# EAGLE schematic MMC_2 (EAGLE 9.6.2)
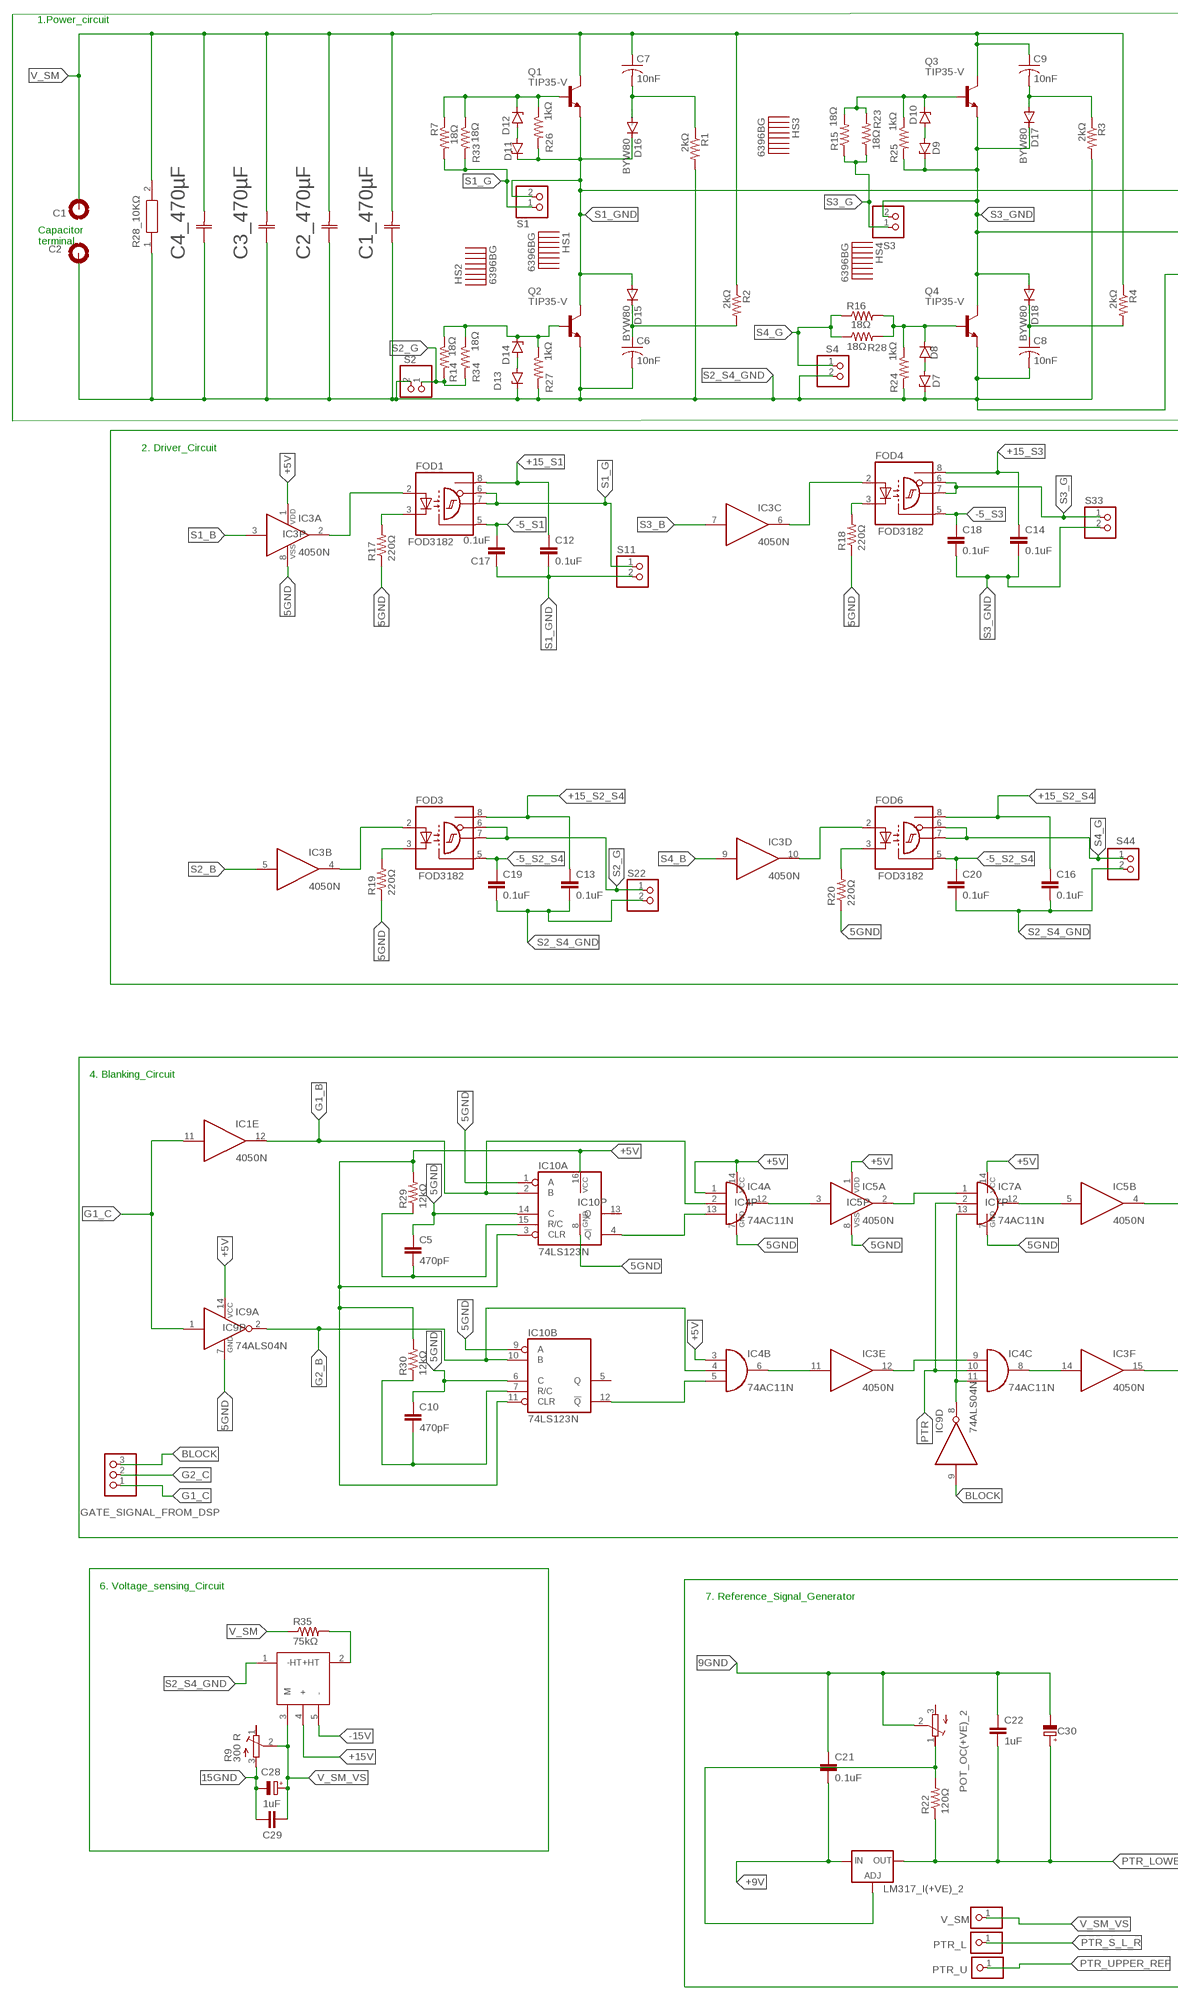
[diagram p0: schematic, sheet 1, part 1 of 2]
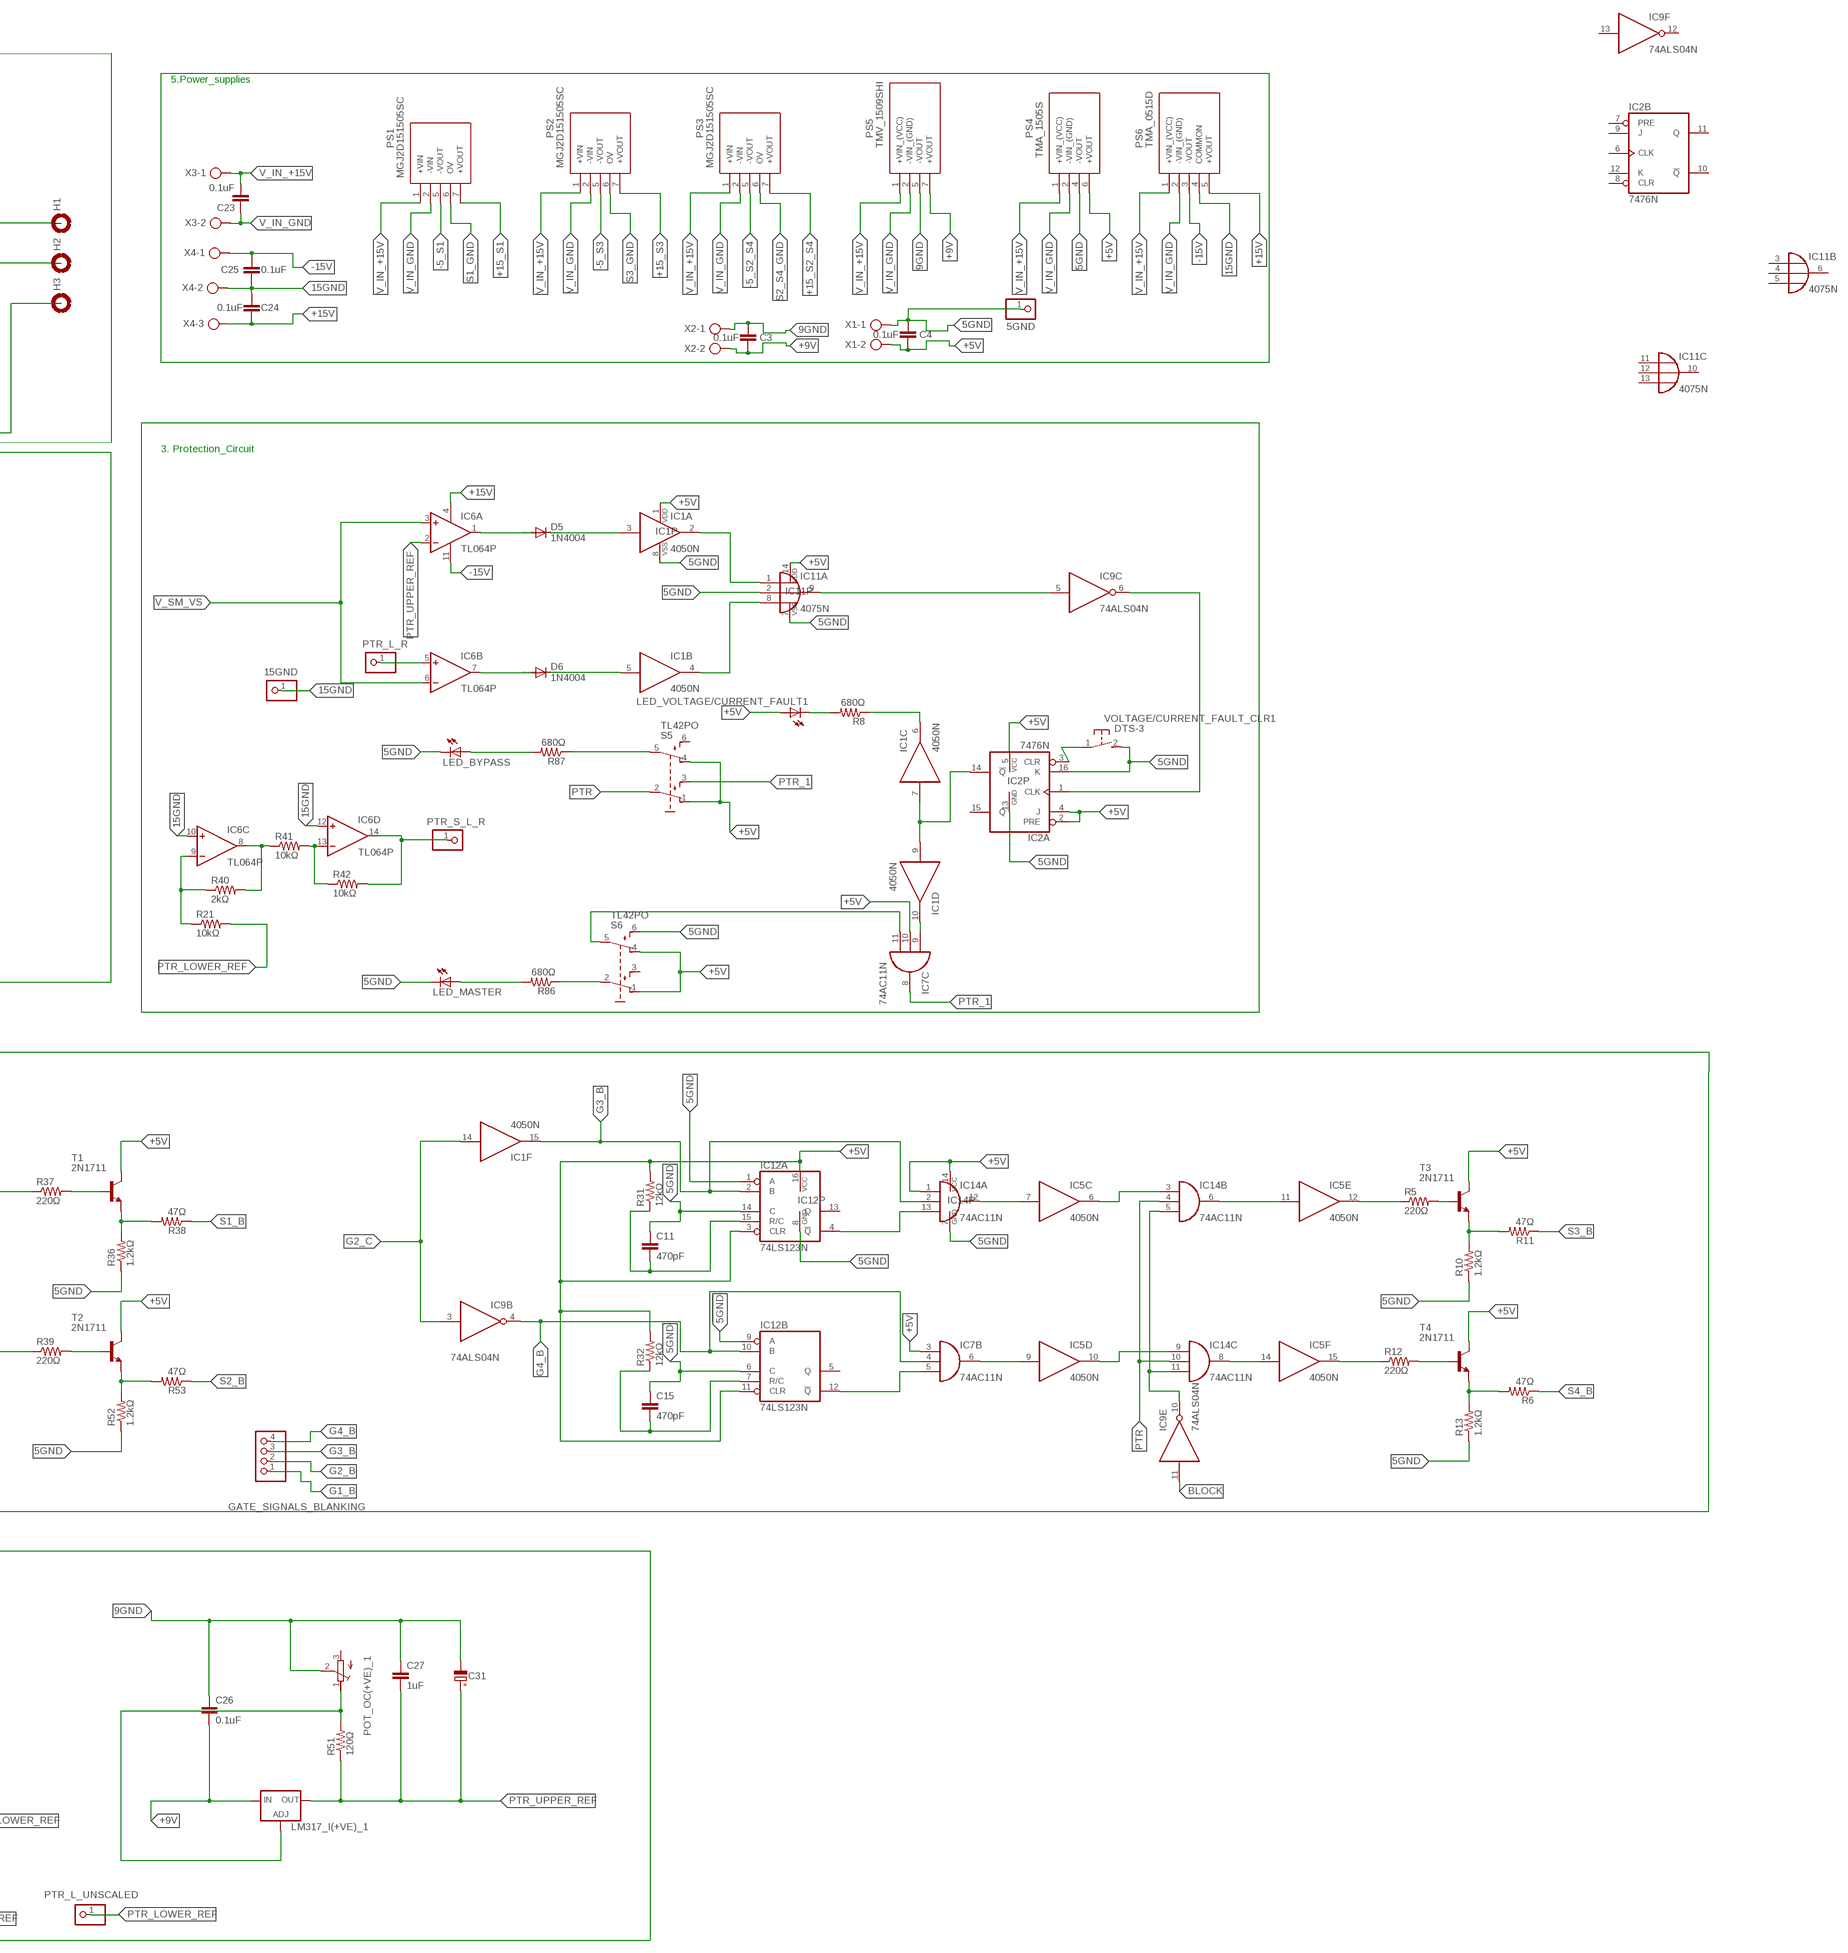
[diagram p1: schematic, sheet 1, part 2 of 2]

## Parts
5GND  PINHD-1X1  [1X01]
15GND  PINHD-1X1  [1X01]
C1  MOUNT-PAD-ROUND  [6-PAD]
C1_470µF  MAL215746471E3  [CAP_2157_30X50_VIS]
C2  MOUNT-PAD-ROUND  [6-PAD]
C2_470µF  MAL215746471E3  [CAP_2157_30X50_VIS]
C3  0.1uF  C-EU025-025X050  [C025-025X050]
C3_470µF  MAL215746471E3  [CAP_2157_30X50_VIS]
C4  0.1uF  C-EU025-025X050  [C025-025X050]
C4_470µF  MAL215746471E3  [CAP_2157_30X50_VIS]
C5  470pF  C-EU025-025X050  [C025-025X050]
C6  10nF  C-US150-054X183  [C150-054X183]
C7  10nF  C-US150-054X183  [C150-054X183]
C8  10nF  C-US150-054X183  [C150-054X183]
C9  10nF  C-US150-054X183  [C150-054X183]
C10  470pF  C-EU025-025X050  [C025-025X050]
C11  470pF  C-EU025-025X050  [C025-025X050]
C12  0.1uF  C-EU025-025X050  [C025-025X050]
C13  0.1uF  C-EU025-025X050  [C025-025X050]
C14  0.1uF  C-EU025-025X050  [C025-025X050]
C15  470pF  C-EU025-025X050  [C025-025X050]
C16  0.1uF  C-EU025-025X050  [C025-025X050]
C17  0.1uF  C-EU025-025X050  [C025-025X050]
C18  0.1uF  C-EU025-025X050  [C025-025X050]
C19  0.1uF  C-EU025-025X050  [C025-025X050]
C20  0.1uF  C-EU025-025X050  [C025-025X050]
C21  0.1uF  C-EU025-025X050  [C025-025X050]
C22  1uF  C-EU025-025X050  [C025-025X050]
C23  0.1uF  C-EU025-025X050  [C025-025X050]
C24  0.1uF  C-EU025-025X050  [C025-025X050]
C25  0.1uF  C-EU025-025X050  [C025-025X050]
C26  0.1uF  C-EU025-025X050  [C025-025X050]
C27  1uF  C-EU025-025X050  [C025-025X050]
C28  CPOL-EUE2-4  [E2-4]
C29  1uF  C-EU025-025X050  [C025-025X050]
C30  CPOL-EUE2-4  [E2-4]
C31  CPOL-EUE2-4  [E2-4]
D5  1N4004  [DO41-10]
D6  1N4004  [DO41-10]
D7  ZENER-DIODEDO35Z10  [DO35Z10]
D8  ZENER-DIODEDO35Z10  [DO35Z10]
D9  ZENER-DIODEDO35Z10  [DO35Z10]
D10  ZENER-DIODEDO35Z10  [DO35Z10]
D11  ZENER-DIODEDO35Z10  [DO35Z10]
D12  ZENER-DIODEDO35Z10  [DO35Z10]
D13  ZENER-DIODEDO35Z10  [DO35Z10]
D14  ZENER-DIODEDO35Z10  [DO35Z10]
D15  BYW80  [TO220ACS]
D16  BYW80  [TO220ACS]
D17  BYW80  [TO220ACS]
D18  BYW80  [TO220ACS]
FOD1  FOD3182  HCPL2219  [DIL08]
FOD3  FOD3182  HCPL2219  [DIL08]
FOD4  FOD3182  HCPL2219  [DIL08]
FOD6  FOD3182  HCPL2219  [DIL08]
GATE_SIGNAL_FROM_DSP  PINHD-1X3  [1X03]
GATE_SIGNALS_BLANKING  PINHD-1X4  [1X04]
H1  MOUNT-PAD-ROUND  [6-PAD]
H2  MOUNT-PAD-ROUND  [6-PAD]
H3  MOUNT-PAD-ROUND  [6-PAD]
HS1  6396BG  [HSINK_6396BG]
HS2  6396BG  [HSINK_6396BG]
HS3  6396BG  [HSINK_6396BG]
HS4  6396BG  [HSINK_6396BG]
IC1  4050N  [DIL16]
IC2  7476N  [DIL16]
IC3  4050N  [DIL16]
IC4  74AC11N  [DIL14]
IC5  4050N  [DIL16]
IC6  TL064P  [DIL14]
IC7  74AC11N  [DIL14]
IC8  LV25-P  [LV25-P]
IC9  74ALS04N  [DIL14]
IC10  74LS123N  [DIL16]
IC11  4075N  [DIL14]
IC12  74LS123N  [DIL16]
IC14  74AC11N  [DIL14]
LED_BYPASS  LED3MM  [LED3MM]
LED_MASTER  LED3MM  [LED3MM]
LED_VOLTAGE/CURRENT_FAULT1  LED3MM  [LED3MM]
LM317_I(+VE)_1  LM317TS  [317TS]
LM317_I(+VE)_2  LM317TS  [317TS]
POT_OC(+VE)_1  R-TRIMMT93YA  [RTRIMT93YA]
POT_OC(+VE)_2  R-TRIMMT93YA  [RTRIMT93YA]
PS1  MGJ2D151505SC  [MGJ2D151505SC]
PS2  MGJ2D151505SC  [MGJ2D151505SC]
PS3  MGJ2D151505SC  [MGJ2D151505SC]
PS4  TMA_1505S  [TMA0505S]
PS5  TMV_1509SHI  [TMV1512SHI]
PS6  TMA_0515D  [TMA0515D]
PTR_L  PINHD-1X1  [1X01]
PTR_L_R  PINHD-1X1  [1X01]
PTR_L_UNSCALED  PINHD-1X1  [1X01]
PTR_S_L_R  PINHD-1X1  [1X01]
PTR_U  PINHD-1X1  [1X01]
Q1  TIP35-V  [TO247-V]
Q2  TIP35-V  [TO247-V]
Q3  TIP35-V  [TO247-V]
Q4  TIP35-V  [TO247-V]
R1  2kΩ  R-US_0414/15  [0414/15]
R2  2kΩ  R-US_0414/15  [0414/15]
R3  2kΩ  R-US_0414/15  [0414/15]
R4  2kΩ  R-US_0414/15  [0414/15]
R5  220Ω  R-US_0207/10  [0207/10]
R6  47Ω  R-US_0207/10  [0207/10]
R7  18Ω  R-US_0207/10  [0207/10]
R8  680Ω  R-US_0207/10  [0207/10]
R9  300 R  R-TRIMMT93YA  [RTRIMT93YA]
R10  1.2kΩ  R-US_0207/10  [0207/10]
R11  47Ω  R-US_0207/10  [0207/10]
R12  220Ω  R-US_0207/10  [0207/10]
R13  1.2kΩ  R-US_0207/10  [0207/10]
R14  18Ω  R-US_0207/10  [0207/10]
R15  18Ω  R-US_0207/10  [0207/10]
R16  18Ω  R-US_0207/10  [0207/10]
R17  220Ω  R-US_0207/10  [0207/10]
R18  220Ω  R-US_0207/10  [0207/10]
R19  220Ω  R-US_0207/10  [0207/10]
R20  220Ω  R-US_0207/10  [0207/10]
R21  10kΩ  R-US_0207/10  [0207/10]
R22  120Ω  R-US_0207/10  [0207/10]
R23  18Ω  R-US_0207/10  [0207/10]
R24  1kΩ  R-US_0207/10  [0207/10]
R25  1kΩ  R-US_0207/10  [0207/10]
R26  1kΩ  R-US_0207/10  [0207/10]
R27  1kΩ  R-US_0207/10  [0207/10]
R28  18Ω  R-US_0207/10  [0207/10]
R28_10KΩ  SBCHE610KJ  [SBCHE610KJ]
R29  12kΩ  R-US_0207/10  [0207/10]
R30  12kΩ  R-US_0207/10  [0207/10]
R31  12kΩ  R-US_0207/10  [0207/10]
R32  12kΩ  R-US_0207/10  [0207/10]
R33  18Ω  R-US_0207/10  [0207/10]
R34  18Ω  R-US_0207/10  [0207/10]
R35  75kΩ  R-US_0411/15  [0411/15]
R36  1.2kΩ  R-US_0207/10  [0207/10]
R37  220Ω  R-US_0207/10  [0207/10]
R38  47Ω  R-US_0207/10  [0207/10]
R39  220Ω  R-US_0207/10  [0207/10]
R40  2kΩ  R-US_0207/10  [0207/10]
R41  10kΩ  R-US_0207/10  [0207/10]
R42  10kΩ  R-US_0207/10  [0207/10]
R51  120Ω  R-US_0207/10  [0207/10]
R52  1.2kΩ  R-US_0207/10  [0207/10]
R53  47Ω  R-US_0207/10  [0207/10]
R86  680Ω  R-US_0207/10  [0207/10]
R87  680Ω  R-US_0207/10  [0207/10]
S1  PINHD-1X2  [1X02]
S2  PINHD-1X2  [1X02]
S3  PINHD-1X2  [1X02]
S4  PINHD-1X2  [1X02]
S5  TL42PO  [TL4XPO]
S6  TL42PO  [TL4XPO]
S11  PINHD-1X2  [1X02]
S22  PINHD-1X2  [1X02]
S33  PINHD-1X2  [1X02]
S44  PINHD-1X2  [1X02]
T1  2N1711  [TO39]
T2  2N1711  [TO39]
T3  2N1711  [TO39]
T4  2N1711  [TO39]
V_SM  PINHD-1X1  [1X01]
VOLTAGE/CURRENT_FAULT_CLR1  DTS-3  [DTS-3]
X1  AK300/2  [AK300/2]
X2  AK300/2  [AK300/2]
X3  AK300/2  [AK300/2]
X4  AK300/3  [AK300/3]

## Nets
5GND: 5GND.1 C4.2 C5.1 C10.1 C11.1 C15.1 IC1.8(P:VSS) IC2.13(P:GND) IC2.16(A:K) IC3.8(P:VSS) IC4.7(P:GND) IC5.8(P:VSS) IC7.7(P:GND) IC9.7(P:GND) IC10.1(A:A) IC10.6(B:C) IC10.8(P:GND) IC10.9(B:A) IC10.14(A:C) IC11.2(A:I1) IC11.7(P:VSS) IC12.1(A:A) IC12.6(B:C) IC12.8(P:GND) IC12.9(B:A) IC12.14(A:C) IC14.7(P:GND) LED_BYPASS.K(C) LED_MASTER.K(C) PS4.4(-VOUT) R10.1 R13.1 R17.1 R18.1 R19.1 R20.1 R36.1 R52.1 S6.6(S1) VOLTAGE/CURRENT_FAULT_CLR1.2 X1.1
9GND: C3.2 C21.1 C22.1 C26.1 C27.1 C30.- C31.- POT_OC(+VE)_1.2(S) POT_OC(+VE)_2.2(S) PS5.5(-VOUT) X2.1
15GND: 15GND.1 C24.2 C25.2 C28.- C29.2 IC6.10(C:+IN) IC6.12(D:+IN) PS6.4(COMMON) R9.3(A) X4.2
+5V: C4.1 IC1.1(P:VDD) IC2.2(A:PRE) IC2.4(A:J) IC2.5(P:VCC) IC3.1(P:VDD) IC4.1(A:I0) IC4.3(B:I0) IC4.14(P:VCC) IC5.1(P:VDD) IC7.3(B:I0) IC7.10(C:I1) IC7.14(P:VCC) IC9.14(P:VCC) IC10.3(A:CLR) IC10.11(B:CLR) IC10.16(P:VCC) IC11.14(P:VDD) IC12.3(A:CLR) IC12.11(B:CLR) IC12.16(P:VCC) IC14.1(A:I0) IC14.14(P:VCC) LED_VOLTAGE/CURRENT_FAULT1.A PS4.6(+VOUT) R29.2 R30.2 R31.2 R32.2 S5.1(O) S5.4(O1) S6.1(O) S6.4(O1) T1.3(C) T2.3(C) T3.3(C) T4.3(C) X1.2
+9V: C3.1 C21.2 C26.2 LM317_I(+VE)_1.3(IN) LM317_I(+VE)_2.3(IN) PS5.7(+VOUT) X2.2
+15_S1: C12.1 FOD1.8(VCC) PS1.7(+VOUT)
+15_S2_S4: C13.1 C16.1 FOD3.8(VCC) FOD6.8(VCC) PS3.7(+VOUT)
+15_S3: C14.1 FOD4.8(VCC) PS2.7(+VOUT)
+15V: C24.1 IC6.4(P:V+) IC8.4(+) PS6.5(+VOUT) X4.3
-5_S1: C17.2 FOD1.5(GND) PS1.5(-VOUT)
-5_S2_S4: C19.1 C20.1 FOD3.5(GND) FOD6.5(GND) PS3.5(-VOUT)
-5_S3: C18.1 FOD4.5(GND) PS2.5(-VOUT)
-15V: C25.1 IC6.11(P:V-) IC8.5(-) PS6.3(-VOUT) X4.1
AA: D12.C Q1.1(B) R7.1 R26.1 R33.1
BLOCK: GATE_SIGNAL_FROM_DSP.3 IC9.9(D:I) IC9.11(E:I)
G1_B: GATE_SIGNALS_BLANKING.1 IC1.12(E:O) IC4.2(A:I1) IC10.2(A:B)
G1_C: GATE_SIGNAL_FROM_DSP.1 IC1.11(E:I) IC9.1(A:I)
G2_B: GATE_SIGNALS_BLANKING.2 IC4.4(B:I1) IC9.2(A:O) IC10.10(B:B)
G2_C: GATE_SIGNAL_FROM_DSP.2 IC1.14(F:I) IC9.3(B:I)
G3_B: GATE_SIGNALS_BLANKING.3 IC1.15(F:O) IC12.2(A:B) IC14.2(A:I1)
G4_B: GATE_SIGNALS_BLANKING.4 IC7.4(B:I1) IC9.4(B:O) IC12.10(B:B)
GND(5): FOD3.3(C) R19.2
N$1: FOD1.2(A) IC3.2(A:O)
N$2: D8.C Q4.1(B) R16.2 R24.1 R28.2
N$3: D10.C Q3.1(B) R15.2 R23.2 R25.1
N$4: IC7.11(C:I2) S6.5(P1)
N$5: D5.A IC6.1(A:OUT)
N$6: IC1.10(D:O) IC7.9(C:I0)
N$7: C9.2 D17.A R3.1
N$9: IC12.4(A:!Q) IC14.13(A:I2)
N$10: IC5.7(C:I) IC14.12(A:O)
N$11: IC5.6(C:O) IC14.3(B:I0)
N$12: IC5.11(E:I) IC14.6(B:O)
N$13: IC5.12(E:O) R5.1
N$14: R5.2 T3.2(B)
N$15: C8.1 D18.C R4.2
N$16: R10.2 R11.2 T3.1(E)
N$17: IC5.15(F:O) R12.1
N$18: C6.1 D15.C R2.2
N$20: FOD3.2(A) IC3.4(B:O)
N$22: FOD4.2(A) IC3.6(C:O)
N$24: FOD6.2(A) IC3.10(D:O)
N$26: FOD1.3(C) R17.2
N$27: FOD4.3(C) R18.2
N$28: FOD6.3(C) R20.2
N$30: R12.2 T4.2(B)
N$31: R6.2 R13.2 T4.1(E)
N$32: D5.C IC1.3(A:I)
N$33: IC5.5(B:I) IC7.12(A:O)
N$35: IC4.11(C:I2) IC7.13(A:I2) IC9.8(D:O)
N$36: IC7.5(B:I2) IC12.12(B:!Q)
N$37: IC5.9(D:I) IC7.6(B:O)
N$38: IC5.10(D:O) IC14.9(C:I0)
N$39: IC9.10(E:O) IC14.5(B:I2) IC14.11(C:I2)
N$40: IC5.14(F:I) IC14.8(C:O)
N$41: IC6.5(B:+IN) PTR_L_R.1
N$43: IC8.2(+HT) R35.2
N$45: LM317_I(+VE)_1.1(ADJ) POT_OC(+VE)_1.1(E) R51.2
N$46: C7.2 D16.A R1.1
N$48: IC6.9(C:-IN) R21.1 R40.1
N$49: IC6.8(C:OUT) R40.2 R41.1
N$51: D7.A D8.A
N$52: D9.A D10.A
N$53: D11.A D12.A
N$54: D13.A D14.A
N$55: IC9.5(C:I) IC11.9(A:O)
N$56: IC6.13(D:-IN) R41.2 R42.1
N$57: IC1.2(A:O) IC11.1(A:I0)
N$58: D6.A IC6.7(B:OUT)
N$59: IC1.4(B:O) IC11.8(A:I2)
N$60: D6.C IC1.5(B:I)
N$61: LM317_I(+VE)_2.1(ADJ) POT_OC(+VE)_2.1(E) R22.2
N$63: IC2.1(A:CLK) IC9.6(C:O)
N$64: IC1.6(C:O) R8.1
N$65: LED_VOLTAGE/CURRENT_FAULT1.K(C) R8.2
N$67: IC2.3(A:CLR) VOLTAGE/CURRENT_FAULT_CLR1.1
N$90: C5.2 IC10.15(A:R/C) R29.1
N$91: C10.2 IC10.7(B:R/C) R30.1
N$92: C11.2 IC12.15(A:R/C) R31.1
N$95: IC4.13(A:I2) IC10.4(A:!Q)
N$97: IC4.12(A:O) IC5.3(A:I)
N$98: IC5.2(A:O) IC7.1(A:I0)
N$100: IC5.4(B:O) R37.1
N$101: R37.2 T1.2(B)
N$102: R36.2 R38.2 T1.1(E)
N$103: IC3.15(F:O) R39.1
N$104: R39.2 T2.2(B)
N$105: R52.2 R53.2 T2.1(E)
N$107: IC4.5(B:I2) IC10.12(B:!Q)
N$108: IC3.11(E:I) IC4.6(B:O)
N$109: IC3.12(E:O) IC4.9(C:I0)
N$110: IC3.14(F:I) IC4.8(C:O)
N$119: C15.2 IC12.7(B:R/C) R32.1
N$202: R86.1 S6.2(P)
N$203: LED_MASTER.A R86.2
N$205: R87.1 S5.5(P1)
N$208: LED_BYPASS.A R87.2
PTR: IC4.10(C:I1) IC7.2(A:I1) IC14.4(B:I1) IC14.10(C:I1) S5.2(P)
PTR_1: IC7.8(C:O) S5.3(S)
PTR_LOWER_REF: C22.2 C30.+ LM317_I(+VE)_2.2(OUT) PTR_L_UNSCALED.1 R21.2 R22.1
PTR_S_L_R: IC6.14(D:OUT) PTR_L.1 PTR_S_L_R.1 R42.2
PTR_UPPER_REF: C27.2 C31.+ IC6.2(A:-IN) LM317_I(+VE)_1.2(OUT) PTR_U.1 R51.1
Q_BAR: IC1.7(C:I) IC1.9(D:I) IC2.14(A:!Q)
S1_B: IC3.3(A:I) R38.1
S1_G: FOD1.6(VE) FOD1.7(VO) R7.2 R33.2 S1.1 S11.1
S1_GND: C12.2 C17.1 D11.C D15.A D16.C H1.B5,5(MOUNT) PS1.6(OV) Q1.3(E) Q2.2(C) R26.2 S1.2 S11.2
S2_B: IC3.5(B:I) R53.1
S2_G: FOD3.6(VE) FOD3.7(VO) R14.2 R34.2 S2.1 S22.1
S2_S4_GND: C1_470µF.1 C2.B5,5(MOUNT) C2_470µF.1 C3_470µF.1 C4_470µF.1 C6.2 C8.2 C13.2 C16.2 C19.2 C20.2 D7.C D13.C H3.B5,5(MOUNT) IC8.1(-HT) PS3.6(OV) Q2.3(E) Q4.3(E) R1.2 R3.2 R24.2 R27.2 R28_10KΩ.1 S2.2 S4.2 S22.2 S44.2
S3_B: IC3.7(C:I) R11.1
S3_G: FOD4.6(VE) FOD4.7(VO) R15.1 R23.1 S3.1 S33.1
S3_GND: C14.2 C18.2 D9.C D17.C D18.A H2.B5,5(MOUNT) PS2.6(OV) Q3.3(E) Q4.2(C) R25.2 S3.2 S33.2
S4_B: IC3.9(D:I) R6.1
S4_G: FOD6.6(VE) FOD6.7(VO) R16.1 R28.1 S4.1 S44.1
S222: D14.C Q2.1(B) R14.1 R27.1 R34.1
V_IN_+15V: C23.2 PS1.1(+VIN) PS2.1(+VIN) PS3.1(+VIN) PS4.1(+VIN_(VCC)) PS5.1(+VIN_(VCC)) PS6.1(+VIN_(VCC)) X3.1
V_IN_GND: C23.1 PS1.2(-VIN) PS2.2(-VIN) PS3.2(-VIN) PS4.2(-VIN_(GND)) PS5.2(-VIN_(GND)) PS6.2(-VIN_(GND)) X3.2
V_SM: C1.B5,5(MOUNT) C1_470µF.2 C2_470µF.2 C3_470µF.2 C4_470µF.2 C7.1 C9.1 Q1.2(C) Q3.2(C) R2.1 R4.1 R28_10KΩ.2 R35.1
V_SM_VS: C28.+ C29.1 IC6.3(A:+IN) IC6.6(B:-IN) IC8.3(M) R9.2(S) V_SM.1
Unconnected: HS1.1(S) HS1.2(S) HS2.1(S) HS2.2(S) HS3.1(S) HS3.2(S) HS4.1(S) HS4.2(S) IC2.6(B:CLK) IC2.7(B:PRE) IC2.8(B:CLR) IC2.9(B:J) IC2.10(B:!Q) IC2.11(B:Q) IC2.12(B:K) IC2.15(A:Q) IC9.12(F:O) IC9.13(F:I) IC10.5(B:Q) IC10.13(A:Q) IC11.3(B:I0) IC11.4(B:I1) IC11.5(B:I2) IC11.6(B:O) IC11.10(C:O) IC11.11(C:I0) IC11.12(C:I1) IC11.13(C:I2) IC12.5(B:Q) IC12.13(A:Q) POT_OC(+VE)_1.3(A) POT_OC(+VE)_2.3(A) R9.1(E) S5.6(S1) S6.3(S)

## Notes on the sheet
- 1.Power_circuit
- 5.Power_supplies
- Capacitor
  terminal
- 3. Protection_Circuit
- 2. Driver_Circuit
- 4. Blanking_Circuit
- 6. Voltage_sensing_Circuit
- 7. Reference_Signal_Generator

## Library data of the parts
5GND 15GND PTR_L PTR_L_R PTR_L_UNSCALED PTR_S_L_R PTR_U V_SM = pinhead:PINHD-1X1: PIN HEADER
C1 C2 H1-H3 = holes:MOUNT-PAD-ROUND: MOUNTING PAD, round
C1_470µF C2_470µF C3_470µF C4_470µF = MCKLZ400M471O50Y:MAL215746471E3; BUILT_BY: EMA_UL_Team; MANUFACTURER_PART_NUMBER: MAL215746471E3; SOURCELIBRARY: Vishay_2020-02-10; VENDOR: Vishay
C3-C5 C10-C27 C29 = rcl:C-EU: CAPACITOR, European symbol
C6-C9 = rcl:C-US: CAPACITOR, American symbol; SPICEPREFIX: C
C28 C30 C31 = rcl:CPOL-EU: POLARIZED CAPACITOR, European symbol; SPICEPREFIX: C
D5 D6 = diode:1N4004: DIODE general purpose rectifier, 1 A
D7-D14 = diode:ZENER-DIODE: Z-Diode
D15-D18 = diode:BYW80: DIODE high-efficiency fast recovery rectifier (ST)
FOD1 FOD3 FOD4 FOD6 = optocoupler:HCPL2219: HEWLETT PACKARD OPTO COUPLER; MF: AGILENT TECHNOLOGIES; MPN: HCPL-2219-000E; OC_FARNELL: 9995250; OC_NEWARK: 31K6963
GATE_SIGNAL_FROM_DSP = pinhead:PINHD-1X3: PIN HEADER
GATE_SIGNALS_BLANKING = pinhead:PINHD-1X4: PIN HEADER
HS1-HS4 = 6396BG:6396BG: Check availability <https://pricing.snapeda.com/parts/6396BG/Aavid%20Thermalloy/view-part?ref=eda>; AVAILABILITY: In Stock; DESCRIPTION: Heat Sink TO-220, TO-218 Aluminum 4.0W @ 30°C Board Level, Vertical; MF: Aavid Thermalloy; MP: 6396BG; PACKAGE: None; PRICE: None; PURCHASE-URL: https://pricing.snapeda.com/search/part/6396BG/?ref=eda
IC1 IC3 IC5 = 40xx:4050: Hex non-inverting BUFFER
IC2 = 74xx-eu:74*76: Dual J-K FLIP FLOP, preset and clear
IC4 IC7 IC14 = 74xx-eu (1):74*11: Triple 3-input AND gate
IC6 = linear:TL064: OP AMP
IC8 = LV25-P:LV25-P
IC9 = 74xx-eu (1):74*04: Hex INVERTER
IC10 IC12 = 74xx-eu (1):74*123: Retriggerable monostable MULTIVIBRATOR
IC11 = 40xx:4075: Triple 3-input OR
LED_BYPASS LED_MASTER LED_VOLTAGE/CURRENT_FAULT1 = led:LED: LED OSRAM: - CHIPLED LG R971, LG N971, LY N971, LG Q971, LY Q971, LO R971, LY R971 LH N974, LH R974 LS Q976, LO Q976, LY Q976 LO Q996 - Hyper CHIPLED LW Q18S LB Q993, LB Q99A, LB R99A - SideLED LS A670, LO A670, LY A670, LG A670, LP A670 LB A673, LV A673, LT A673, LW A673 LH A674 LY A675 LS A676, LA A676, LO A676, LY A676, LW A676 LS A679, LY A679, LG A679 - Hyper Micro SIDELED® LS Y876, LA Y876, LO Y876, LY Y876 LT Y87S - SmartLED LW L88C, LW L88S LB L89C, LB L89S, LG L890 LS L89K, LO L89K, LY L89K LS L896, LA L896, LO L896, LY L896 - TOPLED LS T670, LO T670, LY T670, LG T670, LP T670 LSG T670, LSP T670, LSY T670, LOP T670, LYG T670 LG T671, LOG T671, LSG T671 LB T673, LV T673, LT T673, LW T673 LH T674 LS T676, LA T676, LO T676, LY T676, LB T676, LH T676, LSB T676, LW T676 LB T67C, LV T67C, LT T67C, LS T67K, LO T67K, LY T67K, LW E67C LS E67B, LA E67B, LO E67B, LY E67B, LB E67C, LV E67C, LT E67C LW T67C LS T679, LY T679, LG T679 LS T770, LO T770, LY T770, LG T770, LP T770 LB T773, LV T773, LT T773, LW T773 LH T774 LS E675, LA E675, LY E675, LS T675 LS T776, LA T776, LO T776, LY T776, LB T776 LHGB T686 LT T68C, LB T68C - Hyper Mini TOPLED® LB M676 - Mini TOPLED Santana® LG M470 LS M47K, LO M47K, LY M47K Source: http://www.osram.convergy.de LUXEON: - LUMILED® LXK2-PW12-R00, LXK2-PW12-S00, LXK2-PW14-U00, LXK2-PW14-V00 LXK2-PM12-R00, LXK2-PM12-S00, LXK2-PM14-U00 LXK2-PE12-Q00, LXK2-PE12-R00, LXK2-PE12-S00, LXK2-PE14-T00, LXK2-PE14-U00 LXK2-PB12-K00, LXK2-PB12-L00, LXK2-PB12-M00, LXK2-PB14-N00, LXK2-PB14-P00, LXK2-PB14-Q00 LXK2-PR12-L00, LXK2-PR12-M00, LXK2-PR14-Q00, LXK2-PR14-R00 LXK2-PD12-Q00, LXK2-PD12-R00, LXK2-PD12-S00 LXK2-PH12-R00, LXK2-PH12-S00 LXK2-PL12-P00, LXK2-PL12-Q00, LXK2-PL12-R00 Source: www.luxeon.com KINGBRIGHT: KA-3528ASYC Source: www.kingbright.com
LM317_I(+VE)_1 LM317_I(+VE)_2 = v-reg:LM317TS: VOLTAGE REGULATOR
POT_OC(+VE)_1 POT_OC(+VE)_2 R9 = resistor:R-TRIMM: Trimm resistor
PS1-PS3 = MGJ2D151505SC:MGJ2D151505SC: DC/DC Converters Source: Datasheet <http://power.murata.com/data/power/ncl/kdc_mgj2.pdf>; ARROW_PART_NUMBER: MGJ2D151505SC; ARROW_PRICE-STOCK: https://www.arrow.com/en/products/mgj2d151505sc/murata-power-solutions; DESCRIPTION: DC/DC Converters; HEIGHT: 12.75mm; MANUFACTURER_NAME: Murata Electronics; MANUFACTURER_PART_NUMBER: MGJ2D151505SC; MOUSER_PART_NUMBER: 580-MGJ2D151505SC; MOUSER_PRICE-STOCK: https://www.mouser.co.uk/ProductDetail/Murata-Power-Solutions/MGJ2D151505SC?qs=xLDY6iXSiQYIfXYEkf8RzA%3D%3D
PS4 = TMA_1505S:TMA_1505S: 1 Watt DC/DC converter, industrial, +/-10% input, unregulated, 1500 VDC I/O-siolation, encapsulated, SIP-7 package Source: Datasheet <http://uk.rs-online.com/web/p/products/7065051P>; ALLIED_NUMBER: 70406126; DESCRIPTION: 1 Watt DC/DC converter, industrial, +/-10% input, unregulated, 1500 VDC I/O-siolation, encapsulated, SIP-7 package; HEIGHT: 10.45mm; MANUFACTURER_NAME: Traco Power; MANUFACTURER_PART_NUMBER: TMA 1505S; RS_PART_NUMBER: 7065051P; RS_PRICE-STOCK: http://uk.rs-online.com/web/p/products/7065051P
PS5 = TMV_1509SHI:TMV_1509SHI: 1 Watt DC/DC converter, industrial, +/-10% input, unregulated, 5200 VDC I/O-siolation, encapsulated, SIP-7 package Source: Datasheet <https://tracopower.com/tmv-hi-datasheet/>; ALLIED_NUMBER: 70546456; DESCRIPTION: 1 Watt DC/DC converter, industrial, +/-10% input, unregulated, 5200 VDC I/O-siolation, encapsulated, SIP-7 package; HEIGHT: 10.2mm; MANUFACTURER_NAME: Traco Power; MANUFACTURER_PART_NUMBER: TMV 1509SHI; RS_PART_NUMBER: 8159939; RS_PRICE-STOCK: https://uk.rs-online.com/web/p/products/8159939
PS6 = TMA_0515D:TMA_0515D: 1 Watt DC/DC converter, industrial, +/-10% input, unregulated, 1500 VDC I/O-siolation, encapsulated, SIP-7 package Source: Datasheet <http://uk.rs-online.com/web/p/products/1916574P>; DESCRIPTION: 1 Watt DC/DC converter, industrial, +/-10% input, unregulated, 1500 VDC I/O-siolation, encapsulated, SIP-7 package; HEIGHT: 10.45mm; MANUFACTURER_NAME: Traco Power; MANUFACTURER_PART_NUMBER: TMA 0515D; RS_PART_NUMBER: 1916574P; RS_PRICE-STOCK: http://uk.rs-online.com/web/p/products/1916574P
Q1-Q4 = TIP35:TIP35: NPN Power Transistor Check prices <https://pricing.snapeda.com/parts/TIP35/STMicroelectronics/view-part?ref=eda>; AVAILABILITY: In Stock; DESCRIPTION: Bipolar (BJT) Transistor NPN 100V 25A 3MHz 125W Through Hole TO-247-3; MF: STMicroelectronics; MP: TIP35; PACKAGE: TO-247 STMicroelectronics; PRICE: None; PURCHASE-URL: https://pricing.snapeda.com/search/part/TIP35/?ref=eda
R1-R4 R35 = rcl:R-US_: RESISTOR, American symbol; SPICEPREFIX: R
R5-R8 R10-R21 R23-R28 R33 R34 R36-R42 R52 R53 R86 R87 = resistor:R-US_: RESISTOR, American symbol
R22 R29-R32 R51 = rcl:R-US_: RESISTOR, American symbol
R28_10KΩ = SBCHE610KJ:SBCHE610KJ: Wirewound Resistors - Through Hole BCHE 7 W 10K 5% Source: Datasheet <http://uk.rs-online.com/web/p/products/2061209P>; ALLIED_NUMBER: 70064441; DESCRIPTION: Wirewound Resistors - Through Hole BCHE 7 W 10K 5%; HEIGHT: 8.2mm; MANUFACTURER_NAME: TE Connectivity; MANUFACTURER_PART_NUMBER: SBCHE610KJ; RS_PART_NUMBER: 2061209P; RS_PRICE-STOCK: http://uk.rs-online.com/web/p/products/2061209P
S1-S4 S11 S22 S33 S44 = pinhead:PINHD-1X2: PIN HEADER
S5 S6 = switch:TL42PO: TINY SWITCH ON - MOM Source: http://www2.produktinfo.conrad.com/datenblaetter/700000-724999/705152-da-01-de-Subminiaturschalter_TL_36YO.pdf
T1-T4 = transistor-npn:2N1711: NPN Transistor
VOLTAGE/CURRENT_FAULT_CLR1 = switch-tact:DTS-3
X1-X3 = con-ptr500:AK300/2: CONNECTOR; OC_FARNELL: unknown; OC_NEWARK: unknown
X4 = con-ptr500:AK300/3: CONNECTOR; OC_FARNELL: unknown; OC_NEWARK: unknown

## Net classes
0 default: width 0.457 mm, drill 0.457 mm, clearance 0.305 mm